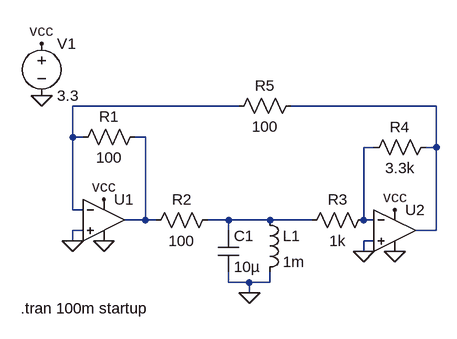
[diagram p0: schematic Draft1.asc]
Draft1.asc, the LTspice schematic file:
Version 4
SHEET 1 880 680
WIRE 336 0 80 0
WIRE 640 0 416 0
WIRE 80 48 80 0
WIRE 96 48 80 48
WIRE 192 48 176 48
WIRE 544 64 528 64
WIRE 640 64 640 0
WIRE 640 64 624 64
WIRE 80 160 80 48
WIRE 96 160 80 160
WIRE 192 176 192 48
WIRE 192 176 160 176
WIRE 208 176 192 176
WIRE 320 176 288 176
WIRE 384 176 320 176
WIRE 448 176 384 176
WIRE 528 176 528 64
WIRE 544 176 528 176
WIRE 96 192 80 192
WIRE 320 192 320 176
WIRE 640 192 640 64
WIRE 640 192 608 192
WIRE 80 208 80 192
WIRE 544 208 528 208
WIRE 528 224 528 208
WIRE 320 272 320 256
WIRE 352 272 320 272
WIRE 384 272 384 256
WIRE 384 272 352 272
WIRE 352 288 352 272
FLAG 128 208 0
FLAG 128 144 vcc
FLAG 32 -96 vcc
FLAG 32 -16 0
FLAG 352 288 0
FLAG 576 224 0
FLAG 576 160 vcc
FLAG 80 208 0
FLAG 528 224 0
SYMBOL OpAmps\\UniversalOpAmp2 128 176 R0
SYMATTR InstName U1
SYMBOL voltage 32 -112 R0
WINDOW 123 0 0 Left 0
WINDOW 39 0 0 Left 0
SYMATTR InstName V1
SYMATTR Value 3.3
SYMBOL ind 368 160 R0
SYMATTR InstName L1
SYMATTR Value 1m
SYMBOL cap 304 192 R0
SYMATTR InstName C1
SYMATTR Value 10µ
SYMBOL res 192 32 R90
WINDOW 0 0 56 VBottom 2
WINDOW 3 32 56 VTop 2
SYMATTR InstName R1
SYMATTR Value 100
SYMBOL res 304 160 R90
WINDOW 0 0 56 VBottom 2
WINDOW 3 32 56 VTop 2
SYMATTR InstName R2
SYMATTR Value 100
SYMBOL res 544 160 R90
WINDOW 0 0 56 VBottom 2
WINDOW 3 32 56 VTop 2
SYMATTR InstName R3
SYMATTR Value 1k
SYMBOL OpAmps\\UniversalOpAmp2 576 192 R0
SYMATTR InstName U2
SYMBOL res 640 48 R90
WINDOW 0 0 56 VBottom 2
WINDOW 3 32 56 VTop 2
SYMATTR InstName R4
SYMATTR Value 3.3k
SYMBOL res 432 -16 R90
WINDOW 0 0 56 VBottom 2
WINDOW 3 32 56 VTop 2
SYMATTR InstName R5
SYMATTR Value 100
TEXT 0 312 Left 2 !.tran 100m startup

The netlist it stands for:
* Draft1.asc
XU1 0 N001 vcc 0 N003 level2 Avol=1Meg GBW=10Meg Slew=10Meg Ilimit=25m Rail=0 Vos=0 En=0 Enk=0 In=0 Ink=0 Rin=500Meg  ; pins In+ In- V+ V- OUT
V1 vcc 0 3.3
L1 N005 0 1m
C1 N005 0 10µ
R1 N003 N001 100
R2 N005 N003 100
R3 N004 N005 1k
XU2 0 N004 vcc 0 N002 level2 Avol=1Meg GBW=10Meg Slew=10Meg Ilimit=25m Rail=0 Vos=0 En=0 Enk=0 In=0 Ink=0 Rin=500Meg  ; pins In+ In- V+ V- OUT
R4 N002 N004 3.3k
R5 N002 N001 100
.tran 100m startup
.lib UniversalOpAmp2.lib
.backanno
.end